# EAGLE design TrimControl (EAGLE 7.2.0)
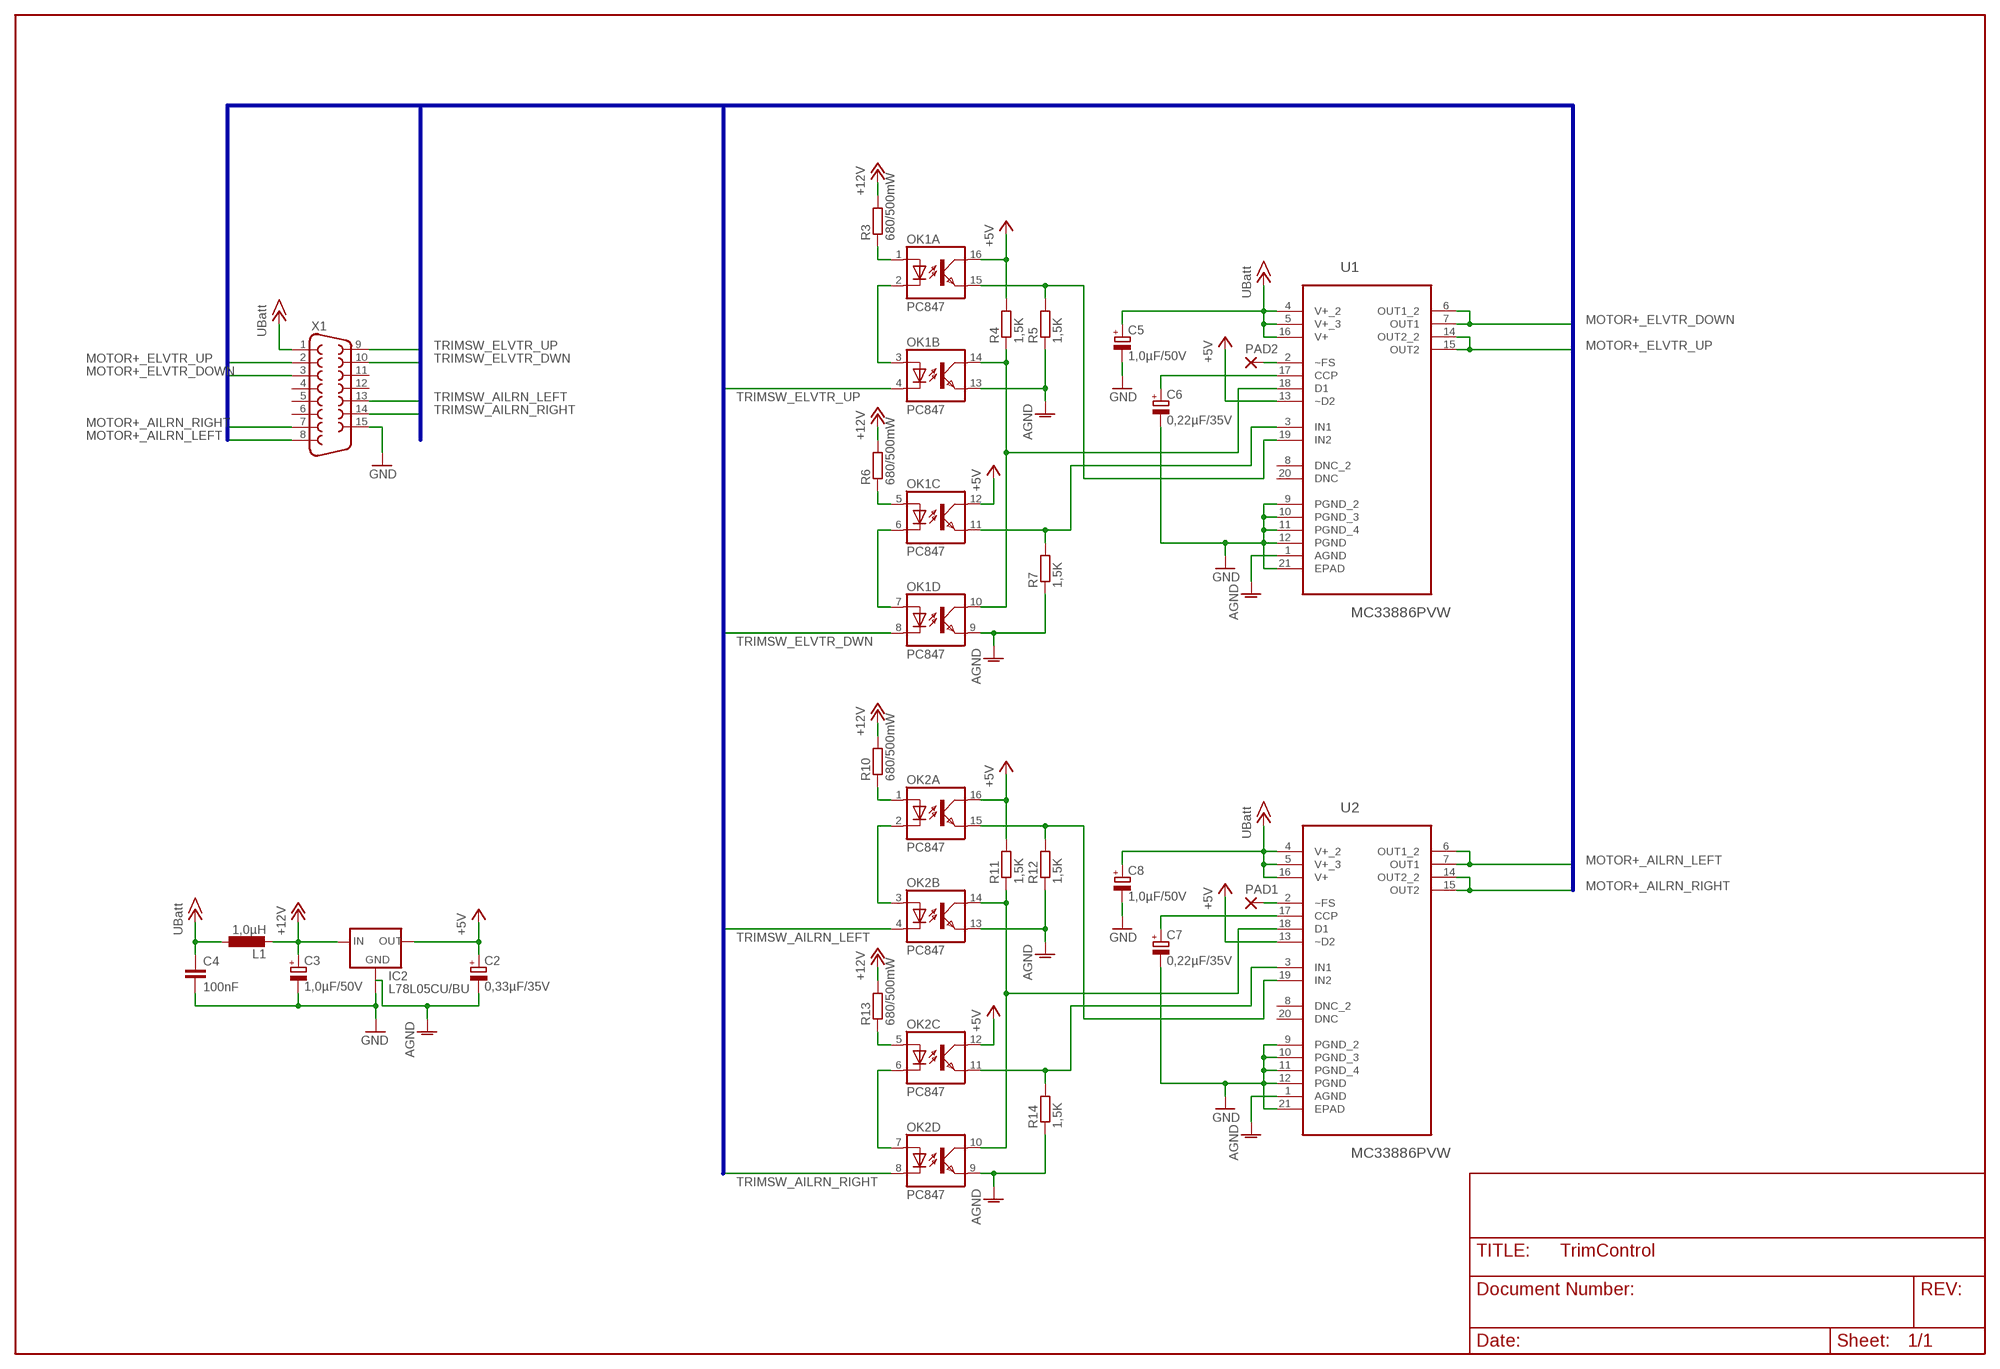
[diagram p0: schematic, sheet 1]

## Parts
C2  0,33µF/35V  CPOL-EUA/3216-18R  [A/3216-18R]
C3  1,0µF/50V  CPOL-EUC/6032-28R  [C/6032-28R]
C4  100nF  C-EUC0805  [C0805]
C5  1,0µF/50V  CPOL-EUC/6032-28R  [C/6032-28R]
C6  0,22µF/35V  CPOL-EUA/3216-18R  [A/3216-18R]
C7  0,22µF/35V  CPOL-EUA/3216-18R  [A/3216-18R]
C8  1,0µF/50V  CPOL-EUC/6032-28R  [C/6032-28R]
IC2  L78L05CU/BU  L78LXXCU/BU  [SOT89]
L1  1,0µH  L-EUL1812  [L1812]
OK1  PC847  [DIL16]
OK2  PC847  [DIL16]
PAD1  1,6/0,9  [1,6/0,9]
PAD2  1,6/0,9  [1,6/0,9]
R3  680/500mW  R-EU_R1210  [R1210]
R4  1,5K  R-EU_R0805  [R0805]
R5  1,5K  R-EU_R0805  [R0805]
R6  680/500mW  R-EU_R1210  [R1210]
R7  1,5K  R-EU_R0805  [R0805]
R10  680/500mW  R-EU_R1210  [R1210]
R11  1,5K  R-EU_R0805  [R0805]
R12  1,5K  R-EU_R0805  [R0805]
R13  680/500mW  R-EU_R1210  [R1210]
R14  1,5K  R-EU_R0805  [R0805]
U1  MC33886PVW  [SOIC127P1420X340-21N]
U2  MC33886PVW  [SOIC127P1420X340-21N]
X1  F15HP  [F15HP]

## Nets
+5V: C2.+ IC2.1(OUT) OK1.12(C:COL) OK1.16(A:COL) OK2.12(C:COL) OK2.16(A:COL) R4.2 R11.2 U1.13(~D2) U2.13(~D2)
+12V: C3.+ IC2.3(IN) L1.2 R3.2 R6.2 R10.2 R13.2
AGND: C2.- IC2.2(GND) OK1.9(D:EMIT) OK1.13(B:EMIT) OK2.9(D:EMIT) OK2.13(B:EMIT) R5.1 R7.1 R12.1 R14.1 U1.1(AGND) U2.1(AGND)
GND: C3.- C4.2 C5.- C6.- C7.- C8.- IC2.4(GND1) U1.9(PGND_2) U1.10(PGND_3) U1.11(PGND_4) U1.12(PGND) U1.21(EPAD) U2.9(PGND_2) U2.10(PGND_3) U2.11(PGND_4) U2.12(PGND) U2.21(EPAD) X1.15
MOTOR+_AILRN_LEFT: U2.6(OUT1_2) U2.7(OUT1) X1.8
MOTOR+_AILRN_RIGHT: U2.14(OUT2_2) U2.15(OUT2) X1.7
MOTOR+_ELVTR_DOWN: U1.6(OUT1_2) U1.7(OUT1) X1.3
MOTOR+_ELVTR_UP: U1.14(OUT2_2) U1.15(OUT2) X1.2
N$1: C6.+ U1.17(CCP)
N$2: C7.+ U2.17(CCP)
N$3: OK1.1(A:A) R3.1
N$6: OK2.1(A:A) R10.1
N$7: OK1.10(D:COL) OK1.14(B:COL) R4.1 U1.18(D1)
N$8: PAD2.1(P) U1.2(~FS)
N$9: PAD1.1(P) U2.2(~FS)
N$10: OK1.2(A:C) OK1.3(B:A)
N$11: OK1.5(C:A) R6.1
N$12: OK1.6(C:C) OK1.7(D:A)
N$13: OK1.15(A:EMIT) R5.2 U1.19(IN2)
N$14: OK2.2(A:C) OK2.3(B:A)
N$15: OK1.11(C:EMIT) R7.2 U1.3(IN1)
N$16: OK2.10(D:COL) OK2.14(B:COL) R11.1 U2.18(D1)
N$17: OK2.5(C:A) R13.1
N$18: OK2.6(C:C) OK2.7(D:A)
N$19: OK2.11(C:EMIT) R14.2 U2.3(IN1)
N$20: OK2.15(A:EMIT) R12.2 U2.19(IN2)
TRIMSW_AILRN_LEFT: OK2.4(B:C) X1.13
TRIMSW_AILRN_RIGHT: OK2.8(D:C) X1.14
TRIMSW_ELVTR_DWN: OK1.8(D:C) X1.10
TRIMSW_ELVTR_UP: OK1.4(B:C) X1.9
UBATT: C4.1 C5.+ C8.+ L1.1 U1.4(V+_2) U1.5(V+_3) U1.16(V+) U2.4(V+_2) U2.5(V+_3) U2.16(V+) X1.1 ; supply symbol labelled UBatt
Unconnected: U1.8(DNC_2) U1.20(DNC) U2.8(DNC_2) U2.20(DNC) X1.4 X1.5 X1.6 X1.11 X1.12

## Buses
B$1

## Library data of the parts
C2 C3 C5-C8 = rcl:CPOL-EU: POLARIZED CAPACITOR, European symbol
C4 = rcl:C-EU: CAPACITOR, European symbol
IC2 = v-reg:L78LXXCU/BU: VOLTAGE REGULATOR
L1 = rcl:L-EU: INDUCTOR, European symbol
OK1 OK2 = optocoupler:PC847: SHARP OPTO COUPLER
PAD1 PAD2 = wirepad:1,6/0,9: THROUGH-HOLE PAD
R3-R7 R10-R14 = rcl:R-EU_: RESISTOR, European symbol
U1 U2 = MC33886PVW:MC33886PVW: H-Bridge; DESCRIPTION: Motor Controller, Dc, Half Bridge, 5a, Hsop-20; DIGI-KEY_PART_NUMBER: MC33886PVW-ND; DIGI-KEY_PURCHASE_URL: https://www.digikey.de/product-detail/en/nxp-usa-inc/MC33886PVW/MC33886PVW-ND/2817276?utm_source=snapeda&utm_medium=aggregator&utm_campaign=symbol; MF: NXP USA; MP: MC33886PVW; PACKAGE: HSOP-20 NXP Semiconductors
X1 = con-subd:F15: SUB-D

## Board
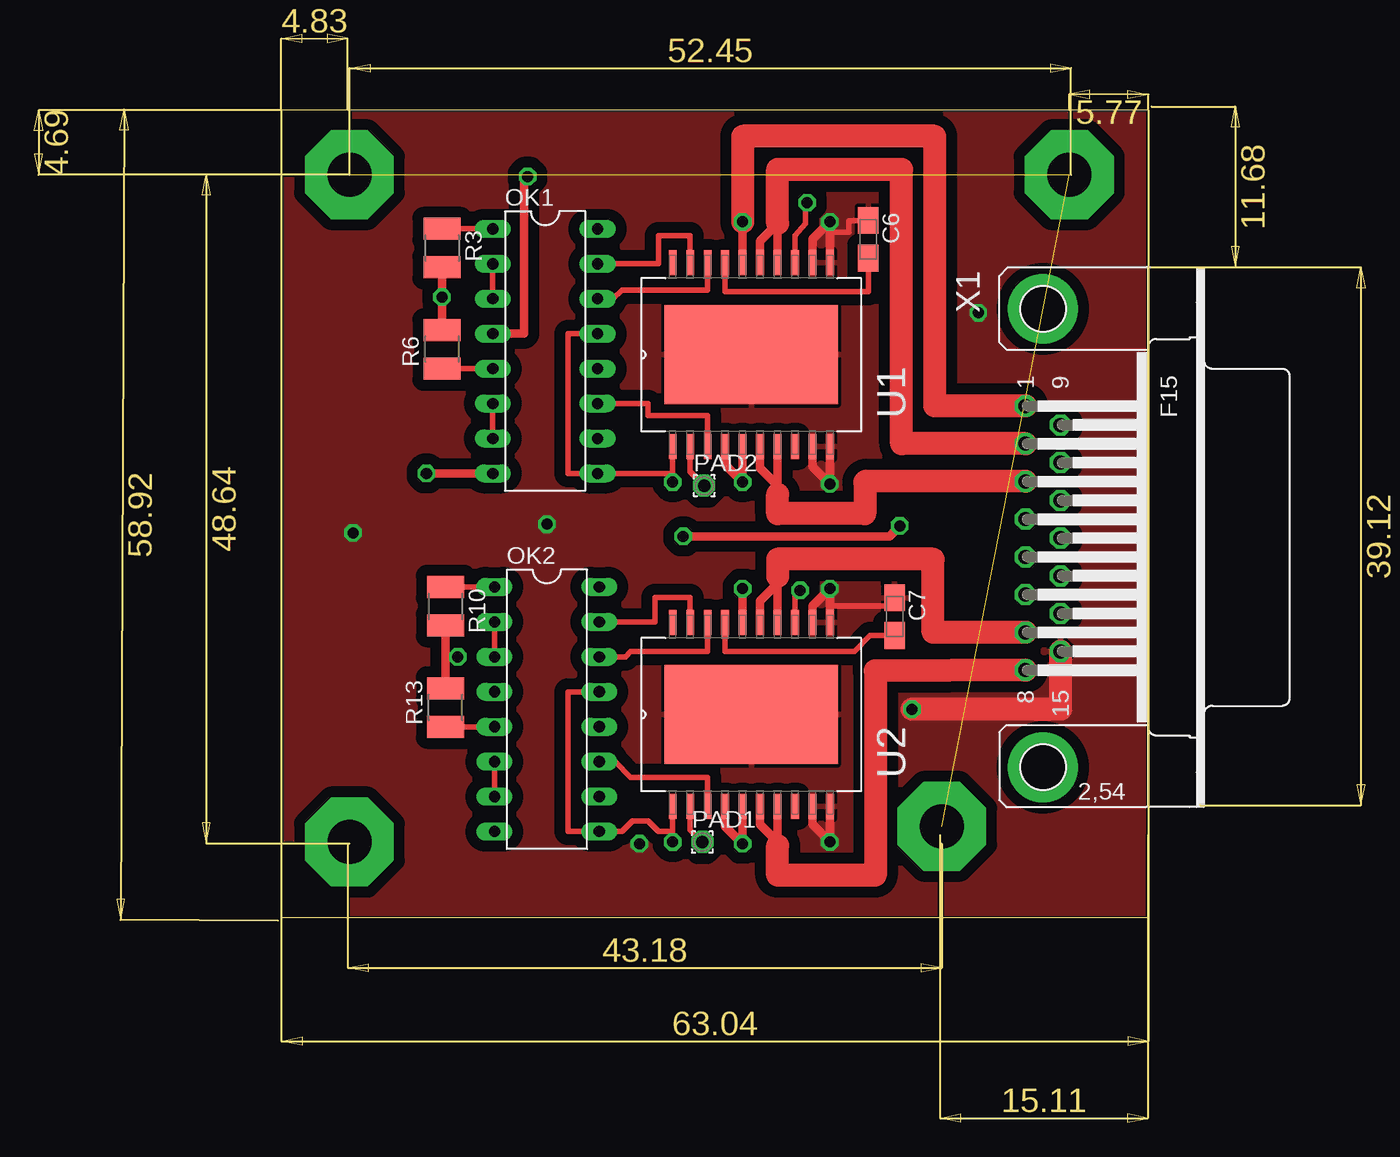
[diagram p1: board, top side]
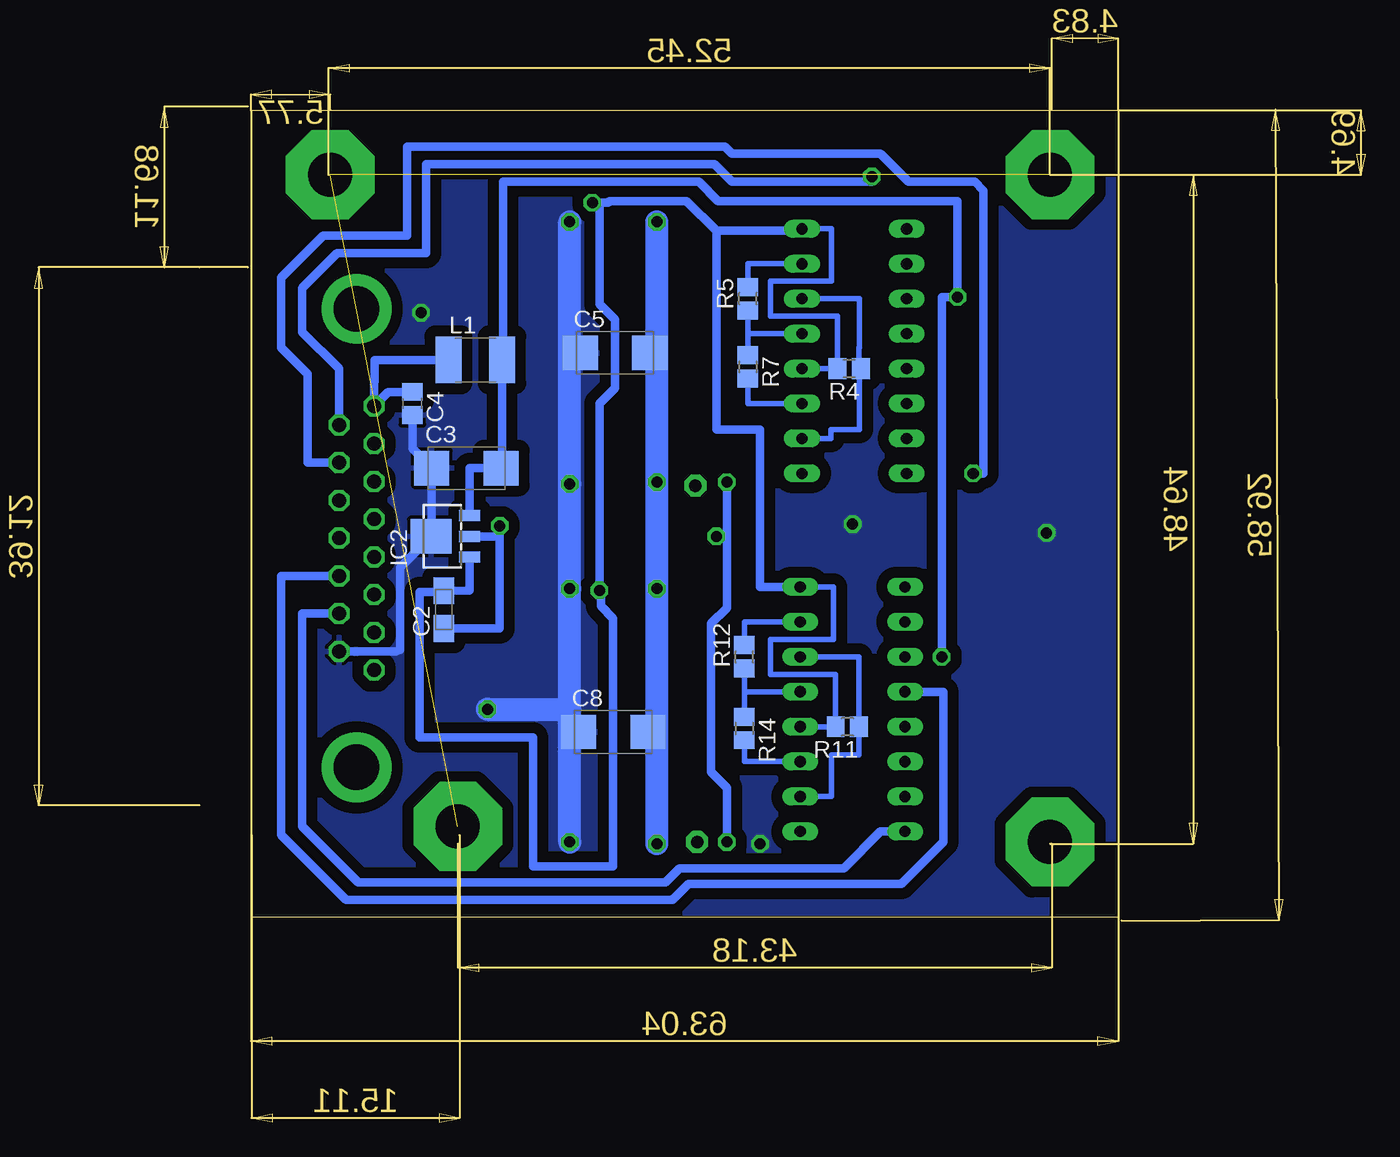
[diagram p2: board, bottom side, seen from below]

Size 63.04 x 58.66 mm. Coordinates in mm from the lower left corner, seen from the top.
Outline: 0,0 63.04,0 63.04,58.66 0,58.66 0,0
Copper layers (1*16): Top 0.035mm / dielectric 1.5mm / Bottom 0.035mm
Design rules "copper": minimum track width 10mil, minimum drill 1mil, track to track 0.8mm, track to pad 0.8mm, pad to pad 0.8mm, via to via 0.8mm, smd to smd 0.4mm, copper to edge 4mil, drill to drill 8mil, minimum pad ring 10mil, minimum via ring 8mil, stop-mask expansion 4mil, vias tented up to drill 0mil, thermal gap 10mil

### Footprints (pad centres in the part's own frame; a part is rotated, then mirrored left to right if it is on the bottom)
A/3216-18R = smd 1.95 x 1.5: + 1.375,0; - -1.375,0
C/6032-28R = smd 2.55 x 2.5: + 2.525,0; - -2.525,0
C0805 = smd 1.3 x 1.5: 1 -0.85,0; 2 0.85,0
SOT89 = smd 0.8 x 1.5: 1 -1.5,-1.75; 2 0,-1.75; 3 1.5,-1.75 | smd 2.5 x 3: 4 0,1.05
L1812 = smd 1.9 x 3.4: 1 -1.95,0; 2 1.95,0
DIL16 = drill 0.813 long: 1 -8.89,-3.81; 2 -6.35,-3.81; 3 -3.81,-3.81; 4 -1.27,-3.81; 5 1.27,-3.81; 6 3.81,-3.81; 7 6.35,-3.81; 8 8.89,-3.81; 9 8.89,3.81; 10 6.35,3.81; 11 3.81,3.81; 12 1.27,3.81; 13 -1.27,3.81; 14 -3.81,3.81; 15 -6.35,3.81; 16 -8.89,3.81
1,6/0,9 = drill 0.914 pad 1.6 octagon: 1 0,0
R1210 = smd 1.6 x 2.7: 1 -1.4,0; 2 1.4,0
R0805 = smd 1.3 x 1.5: 1 -0.85,0; 2 0.85,0
SOIC127P1420X340-21N = smd 1.803 x 0.559: 1 -6.68,5.715; 2 -6.68,4.445; 3 -6.68,3.175; 4 -6.68,1.905; 5 -6.68,0.635; 6 -6.68,-0.635; 7 -6.68,-1.905; 8 -6.68,-3.175; 9 -6.68,-4.445; 10 -6.68,-5.715; 11 6.68,-5.715; 12 6.68,-4.445; 13 6.68,-3.175; 14 6.68,-1.905; 15 6.68,-0.635; 16 6.68,0.635; 17 6.68,1.905; 18 6.68,3.175; 19 6.68,4.445; 20 6.68,5.715 | smd 7.188 x 12.598: 21 0,0
F15HP = drill 1.016 octagon: 1 -9.601,-1.27; 2 -6.858,-1.27; 3 -4.115,-1.27; 4 -1.372,-1.27; 5 1.372,-1.27; 6 4.115,-1.27; 7 6.858,-1.27; 8 9.601,-1.27; 9 -8.23,1.27; 10 -5.486,1.27; 11 -2.743,1.27; 12 0,1.27; 13 2.743,1.27; 14 5.486,1.27; 15 8.23,1.27 | drill 3.302 pad 5.08: G1 -16.662,0; G2 16.662,0

### Placement (x,y rotation side)
C2  49.02,22.35 90 bottom
C3  47.37,32.64 0 bottom
C4  51.31,37.34 270 bottom
C5  36.58,41.02 0 bottom
C6  42.67,49.28 270 top
C7  44.58,21.84 270 top
C8  36.7,13.46 0 bottom
IC2  48.9,27.69 90 bottom
L1  46.74,40.51 0 bottom
OK1  19.18,41.15 270 top
OK2  19.3,15.11 270 top
PAD1  30.61,5.46 0 top
PAD2  30.73,31.37 0 top
R3  11.68,48.64 270 top
R4  19.56,39.88 180 bottom
R5  26.92,44.96 90 bottom
R6  11.68,41.27 90 top
R7  26.92,40.01 270 bottom
R10  11.94,22.61 270 top
R11  19.68,13.84 180 bottom
R12  27.18,18.92 90 bottom
R13  11.94,15.24 90 top
R14  27.18,13.72 270 bottom
U1  34.16,40.89 90 top
U2  34.16,14.73 90 top
X1  55.37,27.56 270 top

### Tracks (layer width: path | path; a pad name or v marks a point on that pad's centre or on a via)
+5V  (via drill 0.8 pad 1.27)
  Top 0.406: U2.13 37.34,23.37 v37.72,23.75 | U1.13 37.34,49.53 38.1,50.42 38.1,51.82 v38.23,51.94
  Bottom 0.406: OK1.12 R4.2 20.41,43.69 25.27,43.69 25.27,46.23 20.83,46.23 20.83,50.04 OK1.16 | OK2.12 R11.2 20.54,17.65 25.27,17.65 25.27,20.19 20.7,20.19 20.7,24 OK2.16 | v38.23,51.94 37.72,51.56
  Bottom 0.61: IC2.1 47.15,23.74 C2.+ 49.02,23.62 50.8,23.62 50.8,13.08 42.55,13.08 42.55,3.68 36.7,3.68 36.7,21.72 37.59,22.61 37.59,23.75 v37.72,23.75 37.72,37.34 36.58,38.48 36.58,43.43 37.72,44.58 37.72,51.56 | OK2.16 26.04,24 26.04,35.43 29.21,35.43 29.21,49.91 | 29.21,49.91 22.99,49.91 OK1.16 | 29.21,49.91 31.37,52.07 36.96,52.07 37.08,51.94 v38.23,51.94
+12V  (via drill 0.8 pad 1.27)
  Top 0.61: R6.2 v11.68,45.09 R3.2 | 11.94,18.92 R10.2 | R13.2 11.94,18.92 | 11.94,18.92 v12.83,18.92
  Bottom 0.61: IC2.3 47.15,32.64 C3.+ 44.79,32.64 L1.2 44.7,40.59 44.7,53.47 30.48,53.47 29.08,52.07 11.68,52.07 v11.68,45.09 12.83,45.09 v12.83,18.92
AGND  (via drill 0.8 pad 1.27)
  Top 0.406: OK1.13 20.83,42.42 20.83,32.26 OK1.9 28.45,32.26 U1.1 v28.45,31.62 | OK2.13 20.83,16.38 20.83,6.22 OK2.9 24.77,6.22 25.53,6.99 26.67,6.99 27.43,6.22 28.45,6.22 U2.1 v28.45,5.46
  Top 0.61: v44.96,28.45 44.2,27.69 v29.21,27.69
  Bottom 0.406: R5.1 26.92,42.42 | 26.92,42.42 OK1.13 | 26.92,42.42 R7.1 | OK2.13 27.18,16.38 | 27.18,16.38 R12.1 | R14.1 27.18,16.38
  Bottom 0.61: v28.45,5.46 28.45,9.4 29.59,10.54 29.59,21.34 28.45,22.48 28.45,27.69 | 28.45,27.69 v28.45,31.62 | IC2.2 44.96,27.69 | 44.96,27.69 v44.96,28.45 | v29.21,27.69 28.45,27.69 | C2.- 44.96,20.98 44.96,27.69
GND  (via drill 0.8 pad 1.27)
  Top 0.406: C6.- 41.27,50.65 41.27,49.78 39.88,49.78 | C7.- 43.92,22.61 39.88,22.61
  Top 0.61: U1.10 v39.88,31.5 38.61,32.77 U1.9 | U1.11 39.88,49.78 v39.88,50.55 38.61,49.28 U1.12 | U2.11 39.88,22.61 v39.88,23.88 38.61,22.61 U2.12 | U2.10 v39.88,5.46 38.61,6.73 U2.9
  Top 1.676: X1.15 56.64,15.11 v45.85,15.11
  Bottom 0.61: C5.- 39.75,41.02 39.88,41.15 | C4.2 51.31,34.05 C3.- 49.9,29.8 IC2.4 52.2,25.43 52.2,19.43 52.48,19.33 X1.15 | C8.- 39.88,13.46
  Bottom 1.676: v39.88,50.55 39.88,41.15 v39.88,31.5 v39.88,23.88 39.88,15.11 | v39.88,5.46 39.88,13.46 39.88,15.11 | v45.85,15.11 39.88,15.11
  other vias: 5.21,27.94 19.3,28.57 50.67,43.94 26.04,5.33
  pour Bottom: -0.25,58.93 63.25,58.93 63.25,-0.25 -0.25,-0.25
  pour Top: -0.25,58.93 63.25,58.93 63.25,-0.25 -0.25,-0.25
MOTOR+_AILRN_LEFT
  Top 0.61: 36.07,5.21 36.07,5.46 | 36.07,5.46 34.8,6.73 U2.6 | U2.7 36.07,5.46
  Top 1.676: X1.8 43.18,17.91 43.18,3.05 36.07,3.05 36.07,5.21
MOTOR+_AILRN_RIGHT
  Top 0.61: 36.07,24.77 36.07,24.26 | 36.07,24.26 34.8,22.99 U2.15 | U2.14 36.07,24.26
  Top 1.676: X1.7 47.37,20.7 47.37,26.04 36.07,26.04 36.07,24.77
MOTOR+_ELVTR_DOWN
  Top 0.61: U1.7 36.07,31.37 | 36.07,31.37 36.07,30.73 | U1.6 34.8,32.64 36.07,31.37
  Top 1.676: X1.3 42.49,31.7 42.42,31.62 42.42,29.34 36.07,29.34 36.07,30.73
MOTOR+_ELVTR_UP
  Top 0.61: U1.14 36.07,50.42 34.8,49.15 U1.15
  Top 1.676: X1.2 45.09,34.42 45.09,54.36 36.07,54.36 36.07,50.42
N$1
  Top 0.406: C6.+ 42.67,45.47 32.26,45.47 U1.17
N$2
  Top 0.406: C7.+ 42.78,20.47 41.66,19.3 32.26,19.3 U2.17
N$3
  Top 0.406: R3.1 OK1.1
N$5  (via drill 3.2 pad 6.45)
  other vias: 4.95,5.46
N$6
  Top 0.406: R10.1 OK2.1
N$7
  Top 0.406: U1.18 30.99,45.59 24.77,45.59 24.13,44.96 OK1.14
  Bottom 0.406: OK1.10 20.87,34.8 20.87,35.43 18.8,35.43 18.8,39.5 R4.1 18.8,40.13 18.84,40.13 18.84,41.4 18.8,41.4 18.8,44.96 OK1.14
N$8
  Top 0.406: U1.2 29.72,32.38 PAD2.1
N$9
  Top 0.406: U2.2 29.72,6.35 PAD1.1
N$10
  Top 0.406: OK1.3 OK1.2
N$11
  Top 0.406: R6.1 OK1.5
N$12
  Top 0.406: OK1.7 OK1.6
N$13
  Top 0.406: U1.19 29.72,49.53 27.43,49.53 27.43,47.5 OK1.15
  Bottom 0.406: OK1.15 26.92,47.5 R5.2 26.92,45.72
N$14
  Top 0.406: OK2.2 OK2.3
N$15
  Top 0.406: U1.3 30.99,36.45 26.67,36.45 26.67,37.34 OK1.11
  Bottom 0.406: OK1.11 26.92,37.34 R7.2 26.92,39.12
N$16
  Top 0.406: U2.18 30.99,19.3 25.4,19.3 25.02,18.92 OK2.14
  Bottom 0.406: OK2.14 18.84,18.92 R11.1 18.84,11.81 20.83,11.81 20.83,8.76 OK2.10
N$17
  Top 0.406: R13.1 OK2.5
N$18
  Top 0.406: OK2.6 OK2.7
N$19
  Top 0.406: U2.3 30.99,10.16 25.4,10.16 24.26,11.3 OK2.11
  Bottom 0.406: OK2.11 27.18,11.3 R14.2
N$20
  Top 0.406: U2.19 29.72,23.24 27.18,23.24 27.18,21.46 OK2.15
  Bottom 0.406: R12.2 27.18,21.46 OK2.15
N$214  (via drill 3.2 pad 6.45)  (2 unrouted)
  other vias: 4.95,53.98 57.28,53.98 48.01,6.6
TRIMSW_AILRN_LEFT
  Bottom 0.61: X1.13 60.83,24.82 60.83,5.97 56.13,1.27 32.38,1.27 31.24,2.41 15.75,2.41 12.7,5.46 12.7,16.38 OK2.4
TRIMSW_AILRN_RIGHT
  Bottom 0.61: X1.14 59.31,22.07 59.31,6.6 55.24,2.54 32.89,2.54 31.88,3.56 19.94,3.56 17.27,6.22 OK2.8
TRIMSW_ELVTR_DWN  (via drill 0.8 pad 1.27)
  Top 0.61: v10.54,32.26 OK1.8
  Bottom 0.61: X1.10 58.93,33.05 58.93,39.5 60.83,41.4 60.83,46.48 57.78,49.53 51.69,49.53 51.69,56.01 28.57,56.01 28.07,55.5 17.27,55.5 15.24,53.47 10.41,53.47 9.78,52.83 9.78,32.26 v10.54,32.26
TRIMSW_ELVTR_UP  (via drill 0.8 pad 1.27)
  Top 0.61: v17.91,53.85 17.65,53.59 17.65,42.42 OK1.4
  Bottom 0.61: X1.9 56.64,39.88 59.31,42.55 59.31,45.72 56.77,48.26 50.29,48.26 50.29,54.74 29.34,54.74 28.07,53.47 17.91,53.47 v17.91,53.85
UBATT  (via drill 0.8 pad 1.27)
  Top 0.61: U1.5 v33.53,31.62 32.26,32.89 U1.4 | v33.53,50.55 U1.16 | U2.5 v33.53,5.33 32.26,6.6 U2.4 | U2.16 v33.53,23.88
  Top 1.676: X1.1 47.5,37.16 47.5,56.77 33.53,56.77 v33.53,50.55
  Bottom 0.61: C5.+ 33.78,41.02 33.53,40.77 | L1.1 54.05,40.51 X1.1 53.07,38.19 C4.1 | C8.+ 33.53,13.46
  Bottom 1.676: v33.53,50.55 33.53,40.77 v33.53,31.62 v33.53,23.88 33.53,13.46 v33.53,5.33